# EAGLE design Eletromiografia (EAGLE 9.3.2)
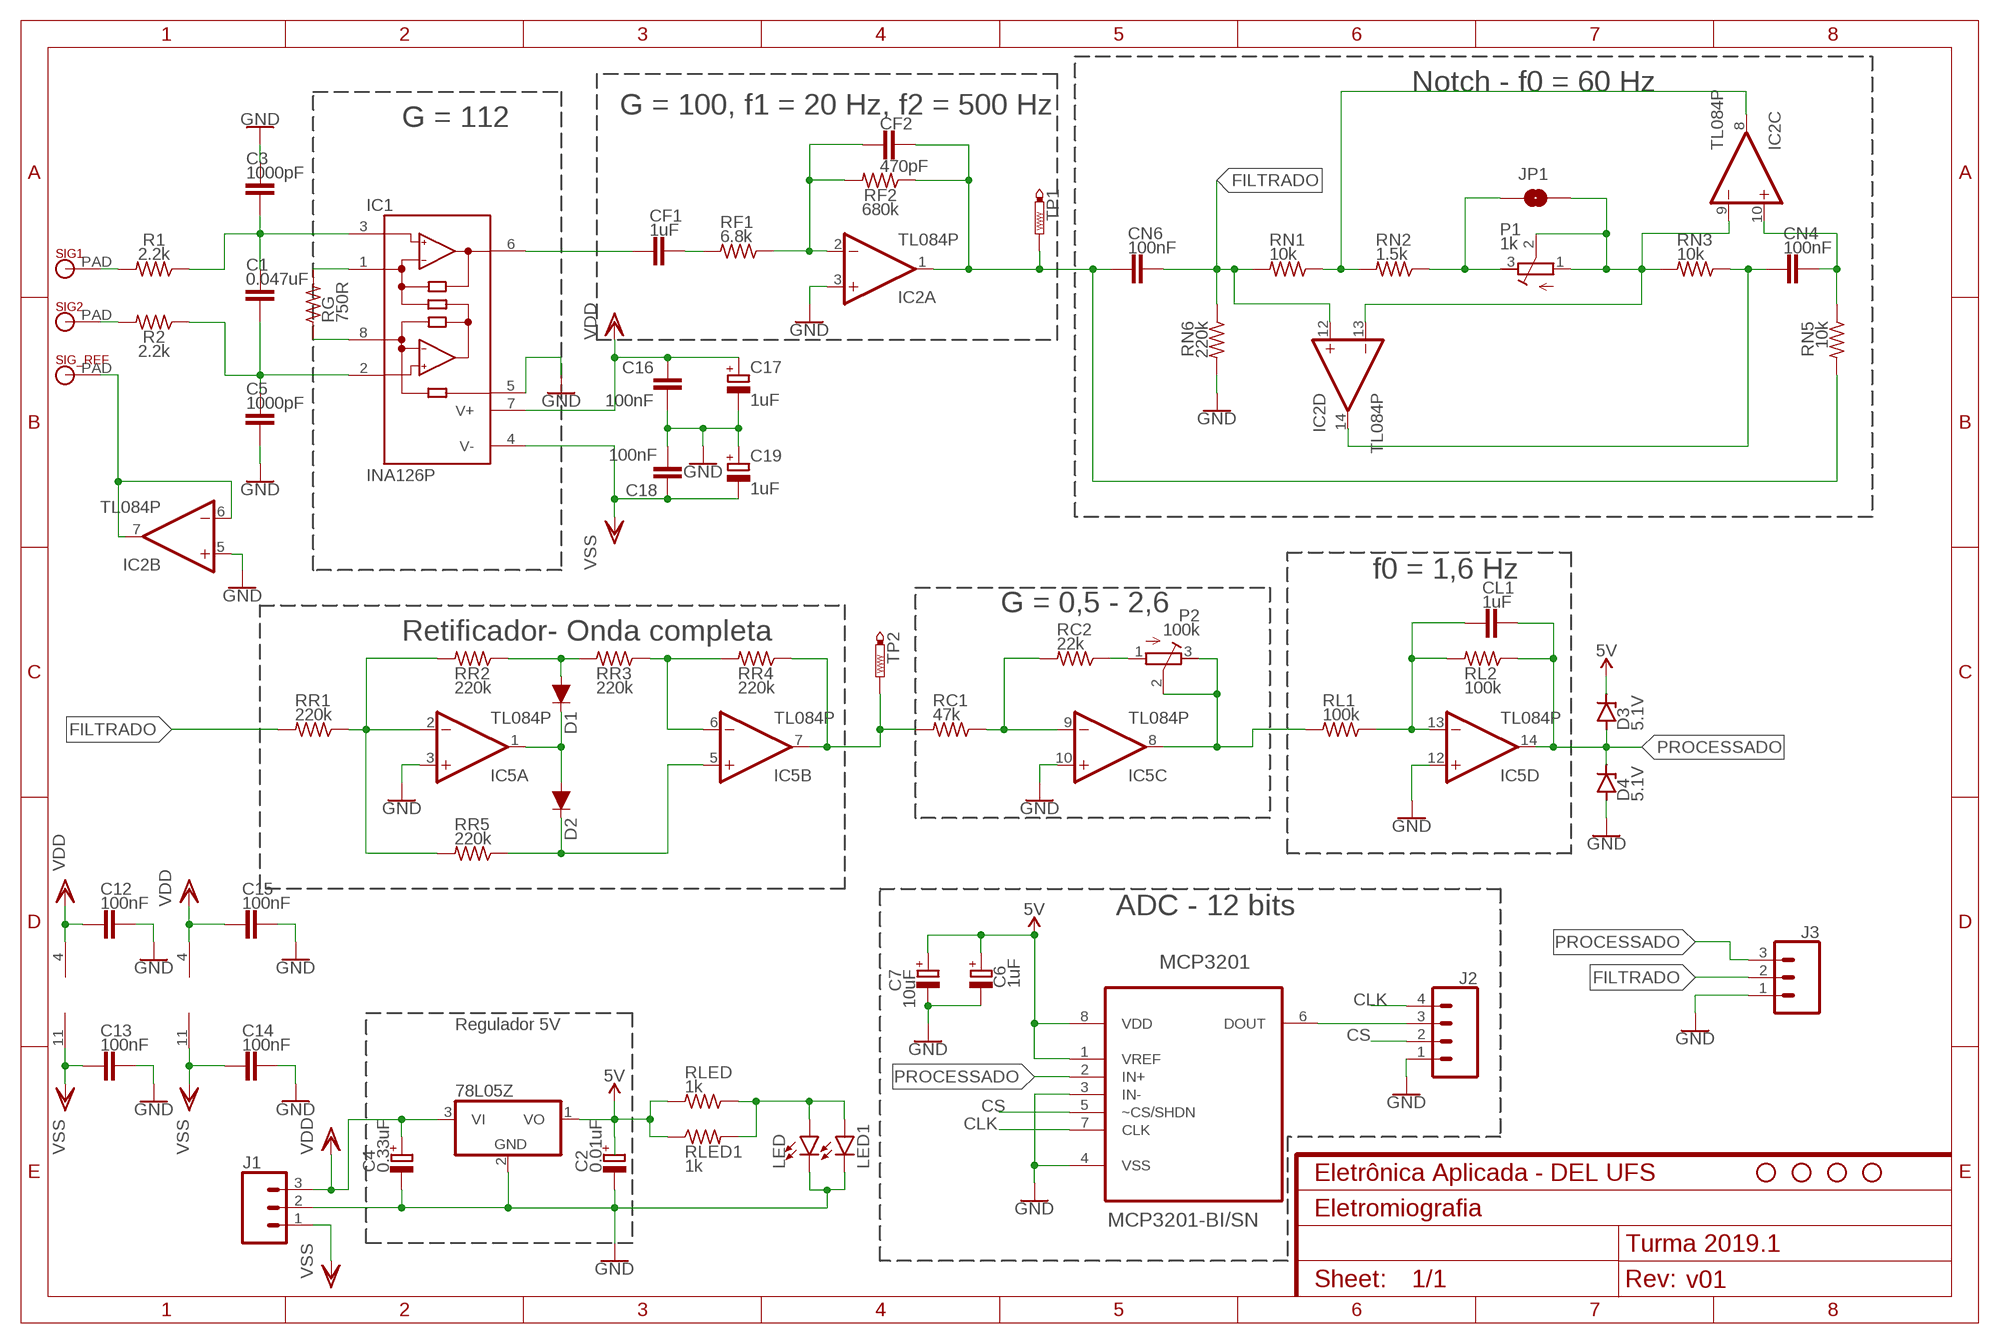
[diagram p0: schematic, sheet 1]
FRAME1 (FRAME-A4L): CNAME: Eletrônica Aplicada - DEL UFS; CREVISION: v01; DESIGNER: Turma 2019.1

## Parts
C1  0.047uF  C-EU025-025X050  [C025-025X050]
C2  0.01uF  CPOL-EUE2.5-6  [E2,5-6]
C3  1000pF  C-EU025-025X050  [C025-025X050]
C4  0.33uF  CPOL-EUE2.5-6  [E2,5-6]
C5  1000pF  C-EU025-025X050  [C025-025X050]
C6  1uF  CPOL-EUE2.5-6  [E2,5-6]
C7  10uF  CPOL-EUE2.5-6  [E2,5-6]
C12  100nF  C-EU025-025X050  [C025-025X050]
C13  100nF  C-EU025-025X050  [C025-025X050]
C14  100nF  C-EU025-025X050  [C025-025X050]
C15  100nF  C-EU025-025X050  [C025-025X050]
C16  100nF  C-EU025-025X050  [C025-025X050]
C17  1uF  CPOL-EUE2.5-6  [E2,5-6]
C18  100nF  C-EU025-025X050  [C025-025X050]
C19  1uF  CPOL-EUE2.5-6  [E2,5-6]
CF1  1uF  C-EU025-025X050  [C025-025X050]
CF2  470pF  C-EU025-025X050  [C025-025X050]
CL1  1uF  C-EU025-025X050  [C025-025X050]
CN4  100nF  C-EU025-025X050  [C025-025X050]
CN6  100nF  C-EU025-025X050  [C025-025X050]
D1  200mA/100V/1V  DIODE-1N4148  [DIODE-1N4148]
D2  200mA/100V/1V  DIODE-1N4148  [DIODE-1N4148]
D3  5.1V  ZENER-DIODEZD-7.5  [ZDIO-7.5]
D4  5.1V  ZENER-DIODEZD-7.5  [ZDIO-7.5]
H1  STAND-OFFTIGHT  [STAND-OFF-TIGHT]
H2  STAND-OFFTIGHT  [STAND-OFF-TIGHT]
H3  STAND-OFFTIGHT  [STAND-OFF-TIGHT]
H4  STAND-OFFTIGHT  [STAND-OFF-TIGHT]
IC1  INA126P  [DIL08]
IC2  TL084P  [DIL14]
IC3  78L05Z  [TO92]
IC5  TL084P  [DIL14]
J1  CONN_03LONGPADS  [1X03_LONGPADS]
J2  CONN_041X04_NO_SILK  [1X04_NO_SILK]
J3  CONN_031X03_NO_SILK  [1X03_NO_SILK]
JP1  JUMPER-SMT_2_NO_NO-SILK_ROUND  [SMT-JUMPER_2_NO_NO-SILK_ROUND]
LED  LED3MM  [LED_3MM]
LED1  LEDCHIP-LED0805  [CHIP-LED0805]
MCP3201  MCP3201-BI/SN  [SOIC127P600X175-8N]
P1  1k  R-TRIMM64W  [RTRIM64W]
P2  100k  R-TRIMM64W  [RTRIM64W]
R1  2.2k  R-US_0207/10  [0207/10]
R2  2.2k  R-US_0207/10  [0207/10]
RC1  47k  R-US_0207/10  [0207/10]
RC2  22k  R-US_0207/10  [0207/10]
RF1  6.8k  R-US_0207/10  [0207/10]
RF2  680k  R-US_0207/10  [0207/10]
RG  750R  R-US_0207/10  [0207/10]
RL1  100k  R-US_0207/10  [0207/10]
RL2  100k  R-US_0207/10  [0207/10]
RLED  1k  R-US_0207/10  [0207/10]
RLED1  1k  R-US_R0805  [R0805]
RN1  10k  R-US_0207/10  [0207/10]
RN2  1.5k  R-US_0207/10  [0207/10]
RN3  10k  R-US_0207/10  [0207/10]
RN5  10k  R-US_0207/10  [0207/10]
RN6  220k  R-US_0207/10  [0207/10]
RR1  220k  R-US_0207/10  [0207/10]
RR2  220k  R-US_0207/10  [0207/10]
RR3  220k  R-US_0207/10  [0207/10]
RR4  220k  R-US_0207/10  [0207/10]
RR5  220k  R-US_0207/10  [0207/10]
SIG1  MICROBIT_PAD  [MICROBIT_PAD]
SIG2  MICROBIT_PAD  [MICROBIT_PAD]
SIG_REF  MICROBIT_PAD  [MICROBIT_PAD]
TP1  PTR1B1,27  [B1,27]
TP2  PTR1B1,27  [B1,27]

## Nets
5V: C2.+ C6.+ C7.+ D3.C IC3.1(VO) MCP3201.1(VREF) MCP3201.8(VDD) RLED1.1 RLED.2
CLK: J2.4 MCP3201.7(CLK)
CS: J2.2 MCP3201.5(~CS/SHDN)
FILTRADO: CN6.2 IC2.12(D:+IN) J3.2 RN1.2 RN6.1 RR1.2
GND: C2.- C3.2 C4.- C5.1 C6.- C7.- C12.2 C13.2 C14.2 C15.2 C16.1 C17.- C18.2 C19.+ D4.A IC1.5(REF) IC2.3(A:+IN) IC2.5(B:+IN) IC3.2(GND) IC5.3(A:+IN) IC5.10(C:+IN) IC5.12(D:+IN) J1.2 J2.1 J3.1 LED1.C LED.K(C) MCP3201.3(IN-) MCP3201.4(VSS) RN6.2
N$1: IC1.1(RG) RG.2
N$2: IC1.8(RG) RG.1
N$3: C1.2 C3.1 IC1.3(+IN) R1.1
N$4: R1.2 SIG1.PAD
N$5: IC2.6(B:-IN) IC2.7(B:OUT) SIG_REF.PAD
N$6: CF1.1 IC1.6(OUT)
N$7: CF1.2 RF1.2
N$8: CF2.1 IC2.2(A:-IN) RF1.1 RF2.2
N$9: JP1.1 P1.3(E) RN2.1
N$10: CF2.2 CN6.1 IC2.1(A:OUT) RF2.1 RN5.2 TP1.TP
N$11: CN4.2 IC2.10(C:+IN) RN5.1
N$12: CN4.1 IC2.14(D:OUT) RN3.1
N$13: C1.1 C5.2 IC1.2(-IN) R2.1
N$14: R2.2 SIG2.PAD
N$15: IC2.8(C:OUT) RN1.1 RN2.2
N$16: IC2.9(C:-IN) IC2.13(D:-IN) JP1.2 P1.1(A) P1.2(S) RN3.2
N$17: J2.3 MCP3201.6(DOUT)
N$18: IC5.2(A:-IN) RR1.1 RR2.2 RR5.2
N$19: D1.A RR2.1 RR3.2
N$20: D1.C D2.A IC5.1(A:OUT)
N$21: D2.C IC5.5(B:+IN) RR5.1
N$22: IC5.6(B:-IN) RR3.1 RR4.2
N$23: IC5.7(B:OUT) RC1.2 RR4.1 TP2.TP
N$24: IC5.9(C:-IN) RC1.1 RC2.2
N$25: P2.1(A) RC2.1
N$26: IC5.8(C:OUT) P2.2(S) P2.3(E) RL1.2
N$28: CL1.1 IC5.13(D:-IN) RL1.1 RL2.2
N$31: LED1.A LED.A RLED1.2 RLED.1
PROCESSADO: CL1.2 D3.A D4.C IC5.14(D:OUT) J3.3 MCP3201.2(IN+) RL2.1
VDD: C4.+ C12.1 C15.1 C16.2 C17.+ IC1.7(V+) IC2.4(P:V+) IC3.3(VI) IC5.4(P:V+) J1.3
VSS: C13.1 C14.1 C18.1 C19.- IC1.4(V-) IC2.11(P:V-) IC5.11(P:V-) J1.1

## Notes on the sheet
- Notch - f0 = 60 Hz
- G = 100, f1 = 20 Hz, f2 = 500 Hz
- G = 112
- f0 = 1,6 Hz
- G = 0,5 - 2,6
- Retificador- Onda completa
- ADC - 12 bits
- Regulador 5V

## Library data of the parts
C1 C3 C5 C12-C16 C18 CF1 CF2 CL1 CN4 CN6 = rcl:C-EU: CAPACITOR, European symbol; SPICEPREFIX: C
C2 C4 C6 C7 C17 C19 = rcl:CPOL-EU: POLARIZED CAPACITOR, European symbol; SPICEPREFIX: C
D1 D2 = SparkFun-DiscreteSemi:DIODE: Diode These are standard reverse protection diodes and small signal diodes. SparkFun Products: SparkFun SparkPunk Sound Kit <https://www.sparkfun.com/products/11177> SparkFun ESP8266 Thing <https://www.sparkfun.com/products/13231>; PROD_ID: DIO-08378
D3 D4 = diode:ZENER-DIODE: Z-Diode
H1-H4 = SparkFun-Hardware:STAND-OFF: Stand Off Drill holes for mechanically mounting via screws, standoffs, etc. Note: Use the keepout ring to avoid running the screw head into surrounding components. Variant Overviews STAND-OFF - Mechanical footprint for a #4 phillips button head screw. STAND-OFF-TIGHT - Mechanical footprint for a #4 phillips button head screw, Example SparkFun Products Screw - Phillips Head (1/4", 4-40, 10 pack) <https://www.sparkfun.com/products/10453> (PRT-10453) Screw - Phillips Head (1/2", 4-40, 10 pack) <https://www.sparkfun.com/products/10452> (PRT-10452) Screw - Phillips Head (3/4", 4-40, 10 pack) <https://www.sparkfun.com/products/10451> (PRT-10451) Screw - Phillips Head (1", 4-40, 10 pack) <https://www.sparkfun.com/products/10450> (PRT-10450)
IC1 = burr-brown:INA126: Instrumentation Amplifier Micropower, Single and Dual Versions; MF: TEXAS INSTRUMENT CONNECTORS; MPN: INA126P; OC_FARNELL: 1509595; OC_NEWARK: 74C9780
IC2 IC5 = linear:TL084: OP AMP
IC3 = linear:78*: Positive VOLTAGE REGULATOR Source: http://cache.national.com/ds/LM/LM78L05.pdf http://www.fairchildsemi.com/ds/LM/LM7805.pdf
J1 J3 = SparkFun-Connectors:CONN_03: Multi connection point. Often used as Generic Header-pin footprint for 0.1 inch spaced/style header connections On any of the 0.1 inch spaced packages, you can populate with these: Break Away Headers - Straight <https://www.sparkfun.com/products/116> (PRT-00116) Break Away Male Headers - Right Angle <https://www.sparkfun.com/products/553> (PRT-00553) Female Headers <https://www.sparkfun.com/products/115> (PRT-00115) Break Away Headers - Machine Pin <https://www.sparkfun.com/products/117> (PRT-00117) Break Away Female Headers - Swiss Machine Pin <https://www.sparkfun.com/products/743> (PRT-00743) Stackable Header - 3 Pin (Female, 0.1") <https://www.sparkfun.com/products/13875> (PRT-13875) For SCREWTERMINALS and SPRING TERMINALS visit here: Screw Terimnals on SparkFun.com <https://www.sparkfun.com/search/results?term=Screw+Terminals> (5mm/3.5mm/2.54mm spacing) This device is also useful as a general connection point to wire up your design to another part of your project. Our various solder wires solder well into these plated through hole pads. Hook-Up Wire - Assortment (Stranded, 22 AWG) <https://www.sparkfun.com/products/11375> (PRT-11375) Hook-Up Wire - Assortment (Solid Core, 22 AWG) <https://www.sparkfun.com/products/11367> (PRT-11367) View the entire wire category on our website here <https://www.sparkfun.com/categories/141> Special notes: Molex polarized connector foot print use with SKU : PRT-08232 with associated crimp pins and housings.
J2 = SparkFun-Connectors:CONN_04: Multi connection point. Often used as Generic Header-pin footprint for 0.1 inch spaced/style header connections On any of the 0.1 inch spaced packages, you can populate with these: Break Away Headers - Straight <https://www.sparkfun.com/products/116> (PRT-00116) Break Away Male Headers - Right Angle <https://www.sparkfun.com/products/553> (PRT-00553) Female Headers <https://www.sparkfun.com/products/115> (PRT-00115) Break Away Headers - Machine Pin <https://www.sparkfun.com/products/117> (PRT-00117) Break Away Female Headers - Swiss Machine Pin <https://www.sparkfun.com/products/743> (PRT-00743) For SCREWTERMINALS and SPRING TERMINALS visit here: Screw Terimnals on SparkFun.com <https://www.sparkfun.com/search/results?term=Screw+Terminals> (5mm/3.5mm/2.54mm spacing) This device is also useful as a general connection point to wire up your design to another part of your project. Our various solder wires solder well into these plated through hole pads. Hook-Up Wire - Assortment (Stranded, 22 AWG) <https://www.sparkfun.com/products/11375> (PRT-11375) Hook-Up Wire - Assortment (Solid Core, 22 AWG) <https://www.sparkfun.com/products/11367> (PRT-11367) View the entire wire category on our website here <https://www.sparkfun.com/categories/141> Special notes: Molex polarized connector foot print use with SKU : PRT-08231 with associated crimp pins and housings. 1MM SMD Version SKU: PRT-10208; PROD_ID: CONN-09696
JP1 = SparkFun-Jumpers:JUMPER-SMT_2_NO: Normally open jumper This jumper has two pads in close proximity to each other. Apply solder to close the connection. Round pads are easier to solder for beginners, but are a lot larger. SparkFun Product that uses the round pads: SparkFun EL Sequencer <https://www.sparkfun.com/products/12781>
LED = SparkFun-LED:LED: LED (Generic) Standard schematic elements and footprints for 5mm, 3mm, 1206, and 0603 sized LEDs. Generic LEDs with no color specified.; PROD_ID: DIO-08794
LED1 = led:LED: LED OSRAM: - CHIPLED LG R971, LG N971, LY N971, LG Q971, LY Q971, LO R971, LY R971 LH N974, LH R974 LS Q976, LO Q976, LY Q976 LO Q996 - Hyper CHIPLED LW Q18S LB Q993, LB Q99A, LB R99A - SideLED LS A670, LO A670, LY A670, LG A670, LP A670 LB A673, LV A673, LT A673, LW A673 LH A674 LY A675 LS A676, LA A676, LO A676, LY A676, LW A676 LS A679, LY A679, LG A679 - Hyper Micro SIDELED® LS Y876, LA Y876, LO Y876, LY Y876 LT Y87S - SmartLED LW L88C, LW L88S LB L89C, LB L89S, LG L890 LS L89K, LO L89K, LY L89K LS L896, LA L896, LO L896, LY L896 - TOPLED LS T670, LO T670, LY T670, LG T670, LP T670 LSG T670, LSP T670, LSY T670, LOP T670, LYG T670 LG T671, LOG T671, LSG T671 LB T673, LV T673, LT T673, LW T673 LH T674 LS T676, LA T676, LO T676, LY T676, LB T676, LH T676, LSB T676, LW T676 LB T67C, LV T67C, LT T67C, LS T67K, LO T67K, LY T67K, LW E67C LS E67B, LA E67B, LO E67B, LY E67B, LB E67C, LV E67C, LT E67C LW T67C LS T679, LY T679, LG T679 LS T770, LO T770, LY T770, LG T770, LP T770 LB T773, LV T773, LT T773, LW T773 LH T774 LS E675, LA E675, LY E675, LS T675 LS T776, LA T776, LO T776, LY T776, LB T776 LHGB T686 LT T68C, LB T68C - Hyper Mini TOPLED® LB M676 - Mini TOPLED Santana® LG M470 LS M47K, LO M47K, LY M47K Source: http://www.osram.convergy.de LUXEON: - LUMILED® LXK2-PW12-R00, LXK2-PW12-S00, LXK2-PW14-U00, LXK2-PW14-V00 LXK2-PM12-R00, LXK2-PM12-S00, LXK2-PM14-U00 LXK2-PE12-Q00, LXK2-PE12-R00, LXK2-PE12-S00, LXK2-PE14-T00, LXK2-PE14-U00 LXK2-PB12-K00, LXK2-PB12-L00, LXK2-PB12-M00, LXK2-PB14-N00, LXK2-PB14-P00, LXK2-PB14-Q00 LXK2-PR12-L00, LXK2-PR12-M00, LXK2-PR14-Q00, LXK2-PR14-R00 LXK2-PD12-Q00, LXK2-PD12-R00, LXK2-PD12-S00 LXK2-PH12-R00, LXK2-PH12-S00 LXK2-PL12-P00, LXK2-PL12-Q00, LXK2-PL12-R00 Source: www.luxeon.com KINGBRIGHT: KA-3528ASYC Source: www.kingbright.com
MCP3201 = MCP3201-BI_SN:MCP3201-BI/SN: 12Bit A/D Converter; AVAILABILITY: Unavailable; DESCRIPTION: Single Channel SPI/Serial Interface 2.7 V 12-Bit A/D Converter SMT - SOIC-8; MF: Microchip; MP: MCP3201-BI/SN; PACKAGE: SOIC-8 Microchip; PRICE: None
P1 P2 = rcl:R-TRIMM: Trimm resistor; SPICEMODEL: X; SPICEPREFIXL: POT
R1 R2 RC1 RC2 RF1 RF2 RG RL1 RL2 RLED RLED1 RN1-RN3 RN5 RN6 RR1-RR5 = rcl:R-US_: RESISTOR, American symbol; SPICEPREFIX: R
SIG1 SIG2 SIG_REF = microbit:MICROBIT_PAD
TP1 TP2 = testpad:PTR1: TEST PIN

## Board
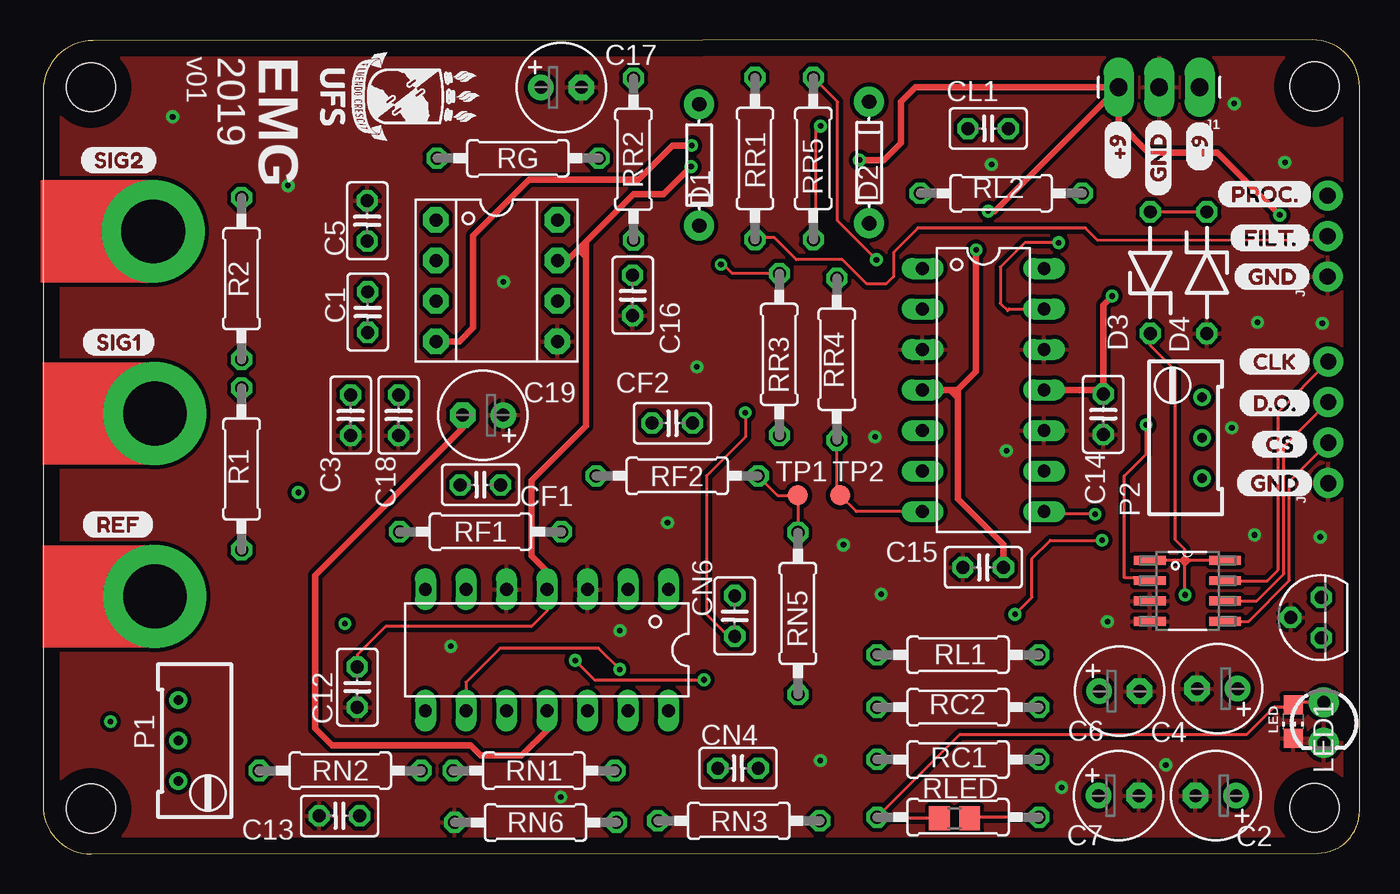
[diagram p1: board, top side]
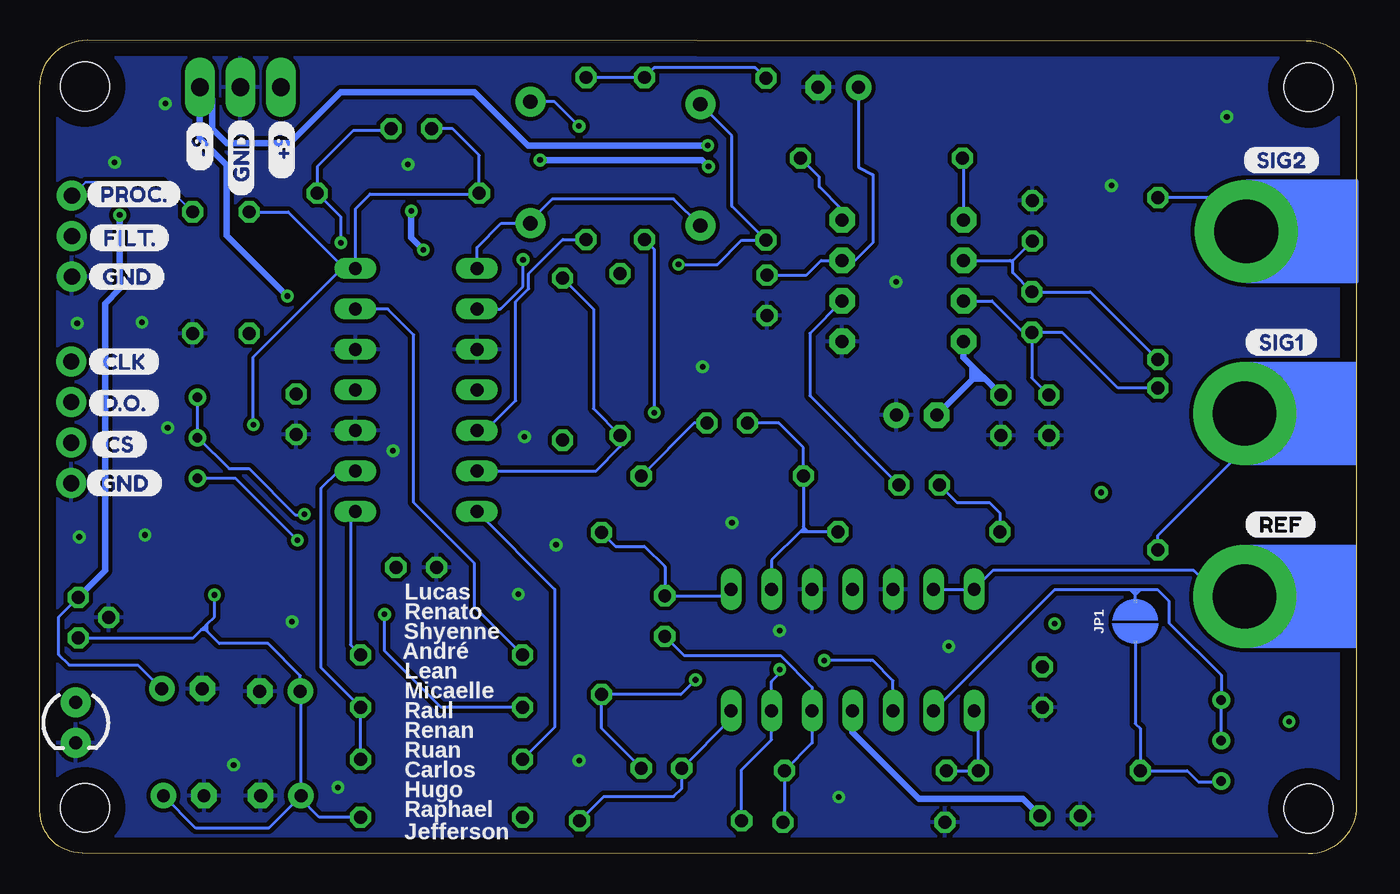
[diagram p2: board, bottom side, seen from below]

Size 82.58 x 51.08 mm. Coordinates in mm from the lower left corner, seen from the top.
Outline: 79.62,51.08 3.15,51.03 arc90 0,47.88 0,3.02 arc90 3.02,0 79.93,0.05 arc90 82.58,2.7 82.58,48.12 arc90 79.62,51.08
Copper layers (1*16): Top 0.035mm / dielectric 1.5mm / Bottom 0.035mm
Design rules "default *": minimum track width 6mil, minimum drill 0.35mm, track to track 6mil, track to pad 6mil, pad to pad 6mil, via to via 6mil, smd to smd 6mil, copper to edge 40mil, drill to drill 8mil, minimum pad ring 10mil, minimum via ring 8mil, stop-mask expansion 4mil, vias tented up to drill 30mil, thermal gap 10mil

### Footprints (pad centres in the part's own frame; a part is rotated, then mirrored left to right if it is on the bottom)
C025-025X050 = drill 0.813 octagon: 1 -1.27,0; 2 1.27,0
E2,5-6 = drill 0.813 pad 1.6: + -1.27,0 | drill 0.813 pad 1.6 octagon: - 1.27,0
DIODE-1N4148 = drill 0.9 pad 1.88: A -3.81,0; C 3.81,0
ZDIO-7.5 = drill 0.813 octagon: A 3.81,0; C -3.81,0
STAND-OFF-TIGHT = hole 3.048: 0,0
DIL08 = drill 0.813 pad 1.6 octagon: 1 -3.81,-3.81; 2 -1.27,-3.81; 3 1.27,-3.81; 4 3.81,-3.81; 5 3.81,3.81; 6 1.27,3.81; 7 -1.27,3.81; 8 -3.81,3.81
DIL14 = drill 0.813 long: 1 -7.62,-3.81; 2 -5.08,-3.81; 3 -2.54,-3.81; 4 0,-3.81; 5 2.54,-3.81; 6 5.08,-3.81; 7 7.62,-3.81; 8 7.62,3.81; 9 5.08,3.81; 10 2.54,3.81; 11 0,3.81; 12 -2.54,3.81; 13 -5.08,3.81; 14 -7.62,3.81
TO92 = drill 0.813 octagon: 1 -1.27,0; 2 0,1.905; 3 1.27,0
1X03_LONGPADS = drill 1.118 pad 1.88 long: 1 0,0; 2 2.54,0; 3 5.08,0
1X04_NO_SILK = drill 1.016 pad 1.88: 1 0,0; 2 2.54,0; 3 5.08,0; 4 7.62,0
1X03_NO_SILK = drill 1.016 pad 1.88: 1 0,0; 2 2.54,0; 3 5.08,0
SMT-JUMPER_2_NO_NO-SILK_ROUND = smd 0.152 x 0.305: 1 -1.27,0; 2 1.27,0
LED_3MM = drill 0.813 pad 1.88: A -1.27,0; K 1.27,0
CHIP-LED0805 = smd 1.2 x 1.2: A 0,-1.05; C 0,1.05
SOIC127P600X175-8N = smd 1.981 x 0.559: 1 -2.362,1.905; 2 -2.362,0.635; 3 -2.362,-0.635; 4 -2.362,-1.905; 5 2.362,-1.905; 6 2.362,-0.635; 7 2.362,0.635; 8 2.362,1.905
RTRIM64W = drill 0.61: 1 1.27,-2.54; 2 1.27,0; 3 1.27,2.54
0207/10 = drill 0.813 octagon: 1 -5.08,0; 2 5.08,0
R0805 = smd 1.3 x 1.5: 1 -0.95,0; 2 0.95,0
MICROBIT_PAD = drill 4 pad 6.452: PAD 0,0
B1,27 = smd 1.27 x 1.27: TP 0,0

### Placement (x,y rotation side)
C1  20.36,34 270 top
C2  73.56,3.66 180 top
C3  19.29,27.53 270 top
C4  73.66,10.36 180 top
C5  20.33,39.72 270 top
C6  67.51,10.21 0 top
C7  67.46,3.66 0 top
C12  19.71,10.46 270 top
C13  18.59,2.39 180 top
C14  66.5,27.58 270 top
C15  58.98,17.98 180 top
C16  36.98,35.05 90 top
C17  32.5,48.09 0 top
C18  22.3,27.53 270 top
C19  27.58,27.53 180 top
CF1  27.43,23.16 180 top
CF2  39.47,27.02 0 top
CL1  59.28,45.51 180 top
CN4  43.59,5.38 0 top
CN6  43.38,14.93 270 top
D1  41.15,43.23 270 top
D2  51.82,43.38 90 top
D3  69.44,36.47 90 top
D4  73,36.47 270 top
H1  3,48.11 0 top
H2  79.76,48.16 0 top
H3  79.76,2.89 0 top
H4  3,2.84 0 top
IC1  28.45,35.96 270 top
IC2  31.6,12.8 180 top
IC3  80.16,14.83 90 top
IC5  58.98,29.11 270 top
J1  72.54,48.11 180 top
J2  80.62,23.26 90 top
J3  80.57,36.22 90 top
JP1  13.87,14.58 90 bottom
LED  80.34,8.23 270 top
LED1  78.41,8.3 180 top
MCP3201  71.78,16.51 0 top
P1  9.75,7.11 180 top
P2  71.42,26.11 0 top
R1  12.45,24.15 270 top
R2  12.45,36.09 90 top
RC1  57.39,5.92 180 top
RC2  57.39,9.21 0 top
RF1  27.43,20.22 180 top
RF2  39.78,23.72 180 top
RG  29.78,43.65 180 top
RL1  57.39,12.49 0 top
RL2  60.1,41.45 0 top
RLED  57.39,2.31 0 top
RLED1  57.18,2.23 180 top
RN1  30.78,5.23 0 top
RN2  18.64,5.23 0 top
RN3  43.64,2.08 180 top
RN5  47.35,15.09 90 top
RN6  30.89,1.98 180 top
RR1  44.65,43.64 270 top
RR2  37.03,43.58 90 top
RR3  46.18,31.34 90 top
RR4  49.78,31.04 90 top
RR5  48.31,43.64 90 top
SIG1  7.01,27.63 270 top
SIG2  6.91,39.06 270 top
SIG_REF  7.01,16.15 270 top
TP1  47.35,22.5 0 top
TP2  49.99,22.5 0 top
U$2  [_#98]  67.41,42.31 90 top
U$3  [#99]  72.54,42.77 90 top
U$4  [GND7]  69.95,41.25 90 top
U$5  [PROC#3]  73.61,41.4 0 top
U$6  [FILT#4]  74.37,38.66 0 top
U$7  [GND7]  74.68,36.22 0 top
U$8  [CLK6]  74.98,30.88 0 top
U$9  [D#O#10]  74.98,28.29 0 top
U$10  [CS5]  75.74,25.7 0 top
U$11  [GND7]  74.83,23.26 0 top
U$12  [SIG21]  2.29,43.53 0 top
U$13  [SIG12]  2.44,32.1 0 top
U$14  [REF0]  2.44,20.67 0 top
U$15  [SIG21]  7.16,43.53 0 bottom
U$16  [SIG12]  7.01,32.1 0 bottom
U$17  [REF0]  7.01,20.67 0 bottom
U$18  [_#98]  67.41,42.31 90 bottom
U$19  [GND7]  69.95,41.25 90 bottom
U$20  [#99]  72.54,42.77 90 bottom
U$21  [PROC#3]  79.71,41.4 0 bottom
U$22  [FILT#4]  79.55,38.66 0 bottom
U$23  [GND7]  79.55,36.22 0 bottom
U$24  [CLK6]  79.55,30.88 0 bottom
U$25  [D#O#10]  79.55,28.29 0 bottom
U$26  [CS5]  79.4,25.7 0 bottom
U$27  [GND7]  79.71,23.26 0 bottom

### Tracks (layer width: path | path; a pad name or v marks a point on that pad's centre or on a via)
5V  (via drill 0.35 pad 0.8)
  Top 0.203: MCP3201.8 71.93,18.41 | 71.91,18.41 71.63,18.41 | 71.63,18.41 71.35,18.41 | 71.32,18.41 MCP3201.1 | v71.63,16.25 71.63,18.11 | 71.63,18.11 71.63,18.41 | 71.63,18.11 71.32,18.41 | 71.63,18.11 71.93,18.41 | 71.63,18.41 71.63,18.69 | D3.C 69.44,31.9 71.02,30.33 71.02,19.71 71.63,19.1 71.63,18.69 | 71.32,18.41 71.35,18.41 | 71.35,18.41 71.63,18.69 | 71.93,18.41 71.91,18.41 | 71.91,18.41 71.63,18.69 | RLED.2 58.2,2.31 RLED1.1
  Bottom 0.203: IC3.1 72.95,13.56 72.47,14.04 | v71.63,16.25 71.63,14.88 72.08,14.43 | 72.47,14.04 72.31,14.2 | 72.31,14.2 72.08,14.43 | 72.08,13.97 71.32,13.21 68.28,13.21 66.24,11.17 C6.+ 66.19,10.16 C7.+ 66.29,3.55 | 72.16,14.04 72.31,14.2 | 72.08,13.97 72.08,14.43 | 72.08,13.97 72.16,14.04 | 72.16,14.04 72.47,14.04 | 66.29,3.55 68.22,1.62 72.8,1.62 C2.+ | RLED.2 65.05,2.31 66.29,3.55
CLK
  Top 0.203: MCP3201.7 76.78,17.14 77.47,17.83 77.47,27.74 J2.4
CS
  Top 0.203: MCP3201.5 75.62,14.6 78.18,17.17 78.18,23.37 J2.2
FILTRADO  (via drill 0.35)
  Top 0.152: 66.14,38.5 80.31,38.5 J3.2
  Top 0.203: v44.04,27.68 44.04,26.16 41.6,23.72 41.6,15.04 42.98,13.66 CN6.2 | 66.14,38.5 65.38,39.27 54.86,39.27 53.34,37.74 53.34,36.22 52.88,35.76 51.66,35.76 50.14,37.29 47.24,37.29 45.87,38.66 44.76,38.66 RR1.2
  Bottom 0.203: CN6.2 42.16,12.44 36.12,12.44 34.14,10.46 IC2.12 34.14,6.96 RN1.2 35.87,2.08 RN6.1 | RR1.2 44.04,37.95 v44.04,27.68
GND  (via drill 0.35 pad 0.8)
  other vias: 15.37,41.93 74.56,26.74 70.42,5.59 63.89,4.18 66.76,14.58 50.2,19.39 52.57,16.29 32.47,3.57 36.18,14.01 25.58,13.03 28.88,35.89 59.49,43.27 74.71,47.08 77.89,43.39 80.24,33.3 76.17,33.36 60.43,25.3 80.11,19.89 75.98,20.01 48.76,5.85 52.18,26.17 39.17,20.78 41.01,30.57 8.13,46.25
  pour Top (isolate 0.254): -4.88,54.81 85.19,54.81 85.19,-7.22 -4.88,-7.22
  pour Bottom (isolate 0.254): -3.2,53.59 85.04,53.59 85.04,-3.1 -3.2,-3.1
N$1
  Bottom 0.203: RG.2 24.64,43.58 IC1.1
N$2
  Bottom 0.203: IC1.8 32.26,40.44 33.68,41.86 33.68,42.47 RG.1
N$3
  Bottom 0.203: R1.1 14.96,29.23 18.45,32.73 C1.2 | C1.2 20.36,29.87 C3.1 | IC1.3 22.86,34.69 20.89,32.73 C1.2
N$4
  Bottom 0.203: R1.2 12.45,19.99 7.9,24.53 7.9,26.74 SIG1.PAD
N$5
  Bottom 0.203: SIG_REF.PAD 8.59,16.15 10.21,17.78 22.81,17.78 IC2.7 IC2.6
N$6
  Bottom 0.203: IC1.6 34.29,32.66 34.29,28.75 CF1.1
N$7
  Bottom 0.203: CF1.2 25.04,22.05 23.01,22.05 22.35,21.39 RF1.2
N$8
  Bottom 0.203: RF1.1 34.44,20.22 | 34.44,20.22 34.75,20.22 | 34.75,20.22 34.9,20.22 | IC2.2 36.68,18.44 34.9,20.22 | 34.7,20.52 RF2.2 34.7,25.5 36.22,27.02 CF2.1 | 34.7,20.42 34.7,20.27 34.75,20.22 | 34.7,20.52 34.7,20.42 | 34.7,20.42 34.9,20.22 | 34.7,20.52 34.44,20.27 34.44,20.22
N$9
  Bottom 0.203: P1.3 8.53,4.52 9.91,4.52 10.62,5.23 RN2.1 13.56,7.87 13.87,8.18 JP1.1
N$10
  Top 0.203: RF2.1 46.08,22.5 TP1.TP RN5.2
  Bottom 0.203: CF2.2 41.55,27.02 RF2.1 | RN5.2 46.48,19.3 44.65,19.3 43.38,18.03 CN6.1 39.62,16.2 IC2.1
N$11  (via drill 0.35 pad 0.8)
  Top 0.203: v33.38,12.14 34.59,10.92 v41.45,10.92
  Bottom 0.203: CN4.2 47.35,7.87 RN5.1 42.37,10.01 v41.45,10.92 | IC2.10 29.06,10.87 30.33,12.14 30.48,12.14 v33.38,12.14
N$12
  Bottom 0.203: RN3.1 47.19,3.61 42.82,3.61 42.32,4.11 CN4.1 39.22,8.48 IC2.14
N$13
  Bottom 0.203: R2.1 16.7,35.27 C1.1 21.55,36.46 21.55,37.07 | IC1.2 21.72,37.23 | 21.72,37.23 21.55,37.23 | 21.55,37.23 C5.2 | 21.55,37.07 21.55,37.23 | 21.55,37.07 21.72,37.23
N$14
  Bottom 0.203: SIG2.PAD 9.02,41.17 R2.2
N$15
  Bottom 0.203: RN1.1 RN2.2 23.72,8.74 IC2.8
N$16  (via drill 0.35 pad 0.8)
  Top 0.203: v36.17,11.57 34.85,12.9 28.65,12.9 26.52,10.77 IC2.9
  Bottom 0.203: P1.2 P1.1 8.48,11.23 11.73,14.48 11.73,15.85 12.45,16.56 13.56,16.56 | RN3.2 38.56,5.28 36.68,7.16 IC2.13 36.68,10.82 36.12,11.38 36.12,11.52 v36.17,11.57 | IC2.9 18.95,16.56 14.17,16.56 | 13.56,16.56 13.87,16.56 | 13.87,16.56 14.17,16.56 | JP1.2 13.87,16.25 | 13.87,16.25 13.87,16.56 | 13.87,16.25 13.56,16.56 | 13.87,16.25 14.17,16.56
N$17
  Top 0.203: MCP3201.6 76.12,15.87 77.83,17.58 77.83,25.55 J2.3
N$18  (via drill 0.35 pad 0.8)
  Top 0.203: RR5.2 49.84,47.19 49.84,39.72 v52.27,37.29
  Bottom 0.203: RR2.2 37.69,49.33 44.04,49.33 RR1.1 RR5.2 | IC5.2 53.7,34.19 52.27,35.61 v52.27,37.29
N$19  (via drill 0.35)
  Top 0.203: RR3.2 43.23,36.42 42.67,36.98 v42.52,36.98
  Bottom 0.203: D1.A 39.17,45.06 39.17,40.64 RR2.1 38.56,38.5 40.08,36.98 v42.52,36.98
N$20
  Bottom 0.203: IC5.1 55.17,38.05 53.65,39.57 51.97,39.57 | 51.97,39.57 D2.A | D1.C 42.82,41.1 46.33,41.1 50.44,41.1 51.97,39.57
N$21  (via drill 0.35 pad 0.8)
  Top 0.203: RR5.1 48.46,38.71 48.46,45.36 v48.77,45.67
  Bottom 0.203: IC5.5 54.61,26.57 52.73,28.45 52.73,34.65 51.92,35.46 51.92,36.42 49.78,38.56 RR5.1 | v48.77,45.67 50.29,47.19 D2.C
N$22
  Bottom 0.203: IC5.6 47.7,24.03 46.18,25.55 RR3.1 47.85,27.94 47.85,34.19 RR4.2
N$23
  Top 0.203: IC5.7 51,21.49 TP2.TP 49.78,22.71 RR4.1
  Bottom 0.203: RC1.2 50.29,7.94 50.29,16.61 IC5.7
N$24
  Bottom 0.203: IC5.9 63.86,24.03 64.92,22.96 64.92,11.66 RC2.2 RC1.1
N$25  (via drill 0.35 pad 0.8)
  Top 0.203: v60.96,15.04 62.03,16.1 62.03,18.54 63.17,19.68 v66.42,19.68
  Bottom 0.203: RC2.1 57.42,9.21 60.96,12.75 v60.96,15.04 | v66.42,19.68 70.31,23.57 P2.1
N$26  (via drill 0.35 pad 0.8)
  Top 0.203: v65.99,21.32 62.95,21.32 IC5.8
  Bottom 0.203: RL1.2 63.09,13.12 63.09,21.18 IC5.8 | P2.3 P2.2 72.64,26.11 70.71,24.18 69.45,24.18 66.55,21.28 65.99,21.28 v65.99,21.32
N$27  (via drill 0.35 pad 0.8)
  other vias: 16,22.68
N$28  (via drill 0.35 pad 0.8)
  Top 0.203: v63.7,38.35 61.57,38.35 60.05,36.83 60.05,34.54 60.5,34.09 60.6,34.19 IC5.13
  Bottom 0.203: CL1.1 60.71,45.36 62.94,45.36 65.18,43.13 RL2.2 63.7,39.98 v63.7,38.35 | RL1.1 55.32,15.5 55.32,18.24 59.13,22.05 59.13,32.56 60.76,34.19 IC5.13
N$29  (via drill 0.35 pad 0.8)
  other vias: 18.94,14.45
N$30  (via drill 0.35 pad 0.8)
  other vias: 4.23,8.3
N$31
  Top 0.203: RLED1.2 52.39,2.23 RLED.1 57.52,7.52 75.51,7.52 77.24,9.24 78.3,9.24 LED1.A 78.55,9.5 LED.A
PROCESSADO  (via drill 0.35 pad 0.8)
  Top 0.203: MCP3201.2 69.24,17.32 67.82,17.32 67.82,23.72 69.19,25.09 v69.19,26.92 | D4.C D3.A
  Bottom 0.152: D4.C 74.88,42.16 79.7,42.16 J3.3
  Bottom 0.203: CL1.2 56.69,45.52 55.02,43.84 RL2.1 55.07,41.4 61.87,41.4 62.79,40.49 IC5.14 | D3.A 67,40.28 63.45,36.73 IC5.14 | v69.19,26.92 69.19,31.19 63.65,36.73 IC5.14
VDD  (via drill 0.35 pad 0.8)
  Top 0.203: IC2.4 31.6,15.24 30.63,14.27 21.49,14.27 19.71,12.5 C12.1
  Top 0.406: J1.3 54.71,48.11 53.8,47.19 53.8,44.6 52.73,43.53 v51.21,43.53 | v40.64,43.13 38.91,41.4 37.03,41.4 34.06,38.43 | IC1.7 32.87,37.23 33.6,37.97 | 34.06,38.43 33.6,37.97 | J1.3 59.69,40.33 v59.28,40.33 | v58.52,37.9 58.52,30.28 57.38,29.13 | 57,29.11 57.35,29.11 57.38,29.13 | 57,29.11 IC5.4 | J1.3 67.46,45.87 69.34,43.99 73.67,43.99 v77.57,40.09 | C15.1 60.25,19.4 57.38,22.27 57.38,28.6 | 57.38,28.6 57.38,29.13 | 57.38,28.6 57,28.98 57,29.11 | 34.06,38.43 34.06,37.44 | 34.06,37.44 34.06,26.85 30.63,23.42 30.63,18.69 31.6,17.73 IC2.4 | 34.06,37.44 33.6,37.9 33.6,37.97
  Bottom 0.203: C17.+ 31.23,43.08 30.33,42.62 30.33,38.35 31.45,37.23 IC1.7 33.58,37.23 34.49,36.32 C16.2 | C4.+ 76.43,11.86 80.75,11.86 81.38,12.5 81.38,14.88 IC3.3
  Bottom 0.406: v51.21,43.53 41.05,43.53 v40.64,43.13 | v59.28,40.33 59.28,38.66 v58.52,37.9 | v77.57,40.09 77.57,35.46 78.49,34.54 78.49,17.78 IC3.3
VSS  (via drill 0.35 pad 0.8)
  Top 0.406: v67.06,35 66.5,34.44 C14.1 66.24,29.11 IC5.11 | v40.69,44.45 39.47,44.45 37.34,42.31 30.48,42.31 26.98,38.81 26.98,33.02 26.11,32.15 IC1.4 | C19.- 26.31,26.72 17.07,17.47 17.07,7.87 18.14,6.81 26.82,6.81 27.43,6.2 30.02,6.2 31.6,7.77 IC2.11
  Bottom 0.406: C13.1 20.93,3.45 27.43,3.45 31.6,7.62 IC2.11 | v67.06,35 70.87,38.81 70.87,43.23 72.54,44.91 J1.1 71.78,47.34 71.78,45.52 70.87,44.6 66.9,44.6 63.7,47.8 55.32,47.8 51.97,44.45 v40.69,44.45 | C18.1 23.32,29.82 | 23.32,29.82 23.62,30.12 | 23.62,30.12 24.08,30.58 | 24.08,30.58 24.64,31.14 IC1.4 | C19.- 24.08,29.77 | 24.03,29.82 23.72,30.12 23.62,30.12 | 24.08,29.77 24.08,30.58 | 24.08,29.77 24.03,29.82 | 24.03,29.82 23.32,29.82

### Text on the board
tPlace: EMG
tNames: v01 | 2019
bNames: Lucas | Renato | Shyenne | André | Lean | Micaelle | Raul | Renan | Ruan | Carlos | Hugo | Raphael | Jefferson